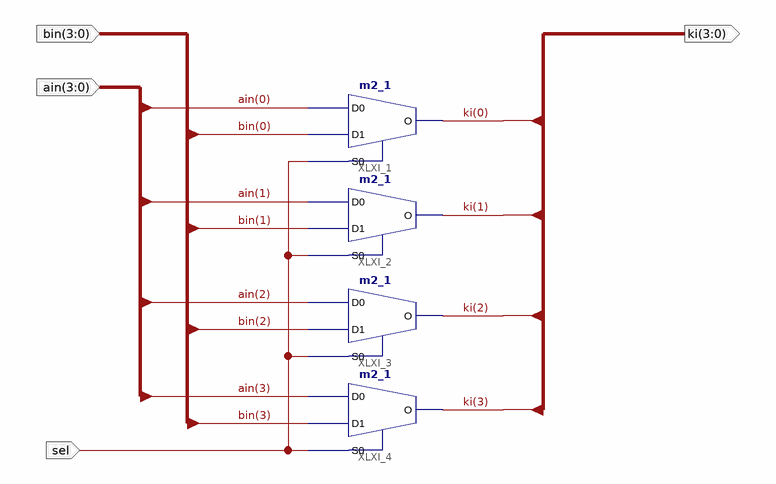
[diagram p0: schematic sheet 1]
// Xilinx ISE schematic mplx_2_1_4bit.sch (spartan3e) as structural Verilog: 4 symbols, 4 ports
module mplx_2_1_4bit (
  input  [3:0] ain,
  input  [3:0] bin,
  input  sel,
  output [3:0] ki
);

  m2_1 XLXI_1 (.D0(ain[0]), .D1(bin[0]), .S0(sel), .O(ki[0]));
  m2_1 XLXI_3 (.D0(ain[2]), .D1(bin[2]), .S0(sel), .O(ki[2]));
  m2_1 XLXI_4 (.D0(ain[3]), .D1(bin[3]), .S0(sel), .O(ki[3]));
  m2_1 XLXI_2 (.D0(ain[1]), .D1(bin[1]), .S0(sel), .O(ki[1]));
endmodule
